# EAGLE design arduino_ver1.0 (EAGLE 9.6.2)
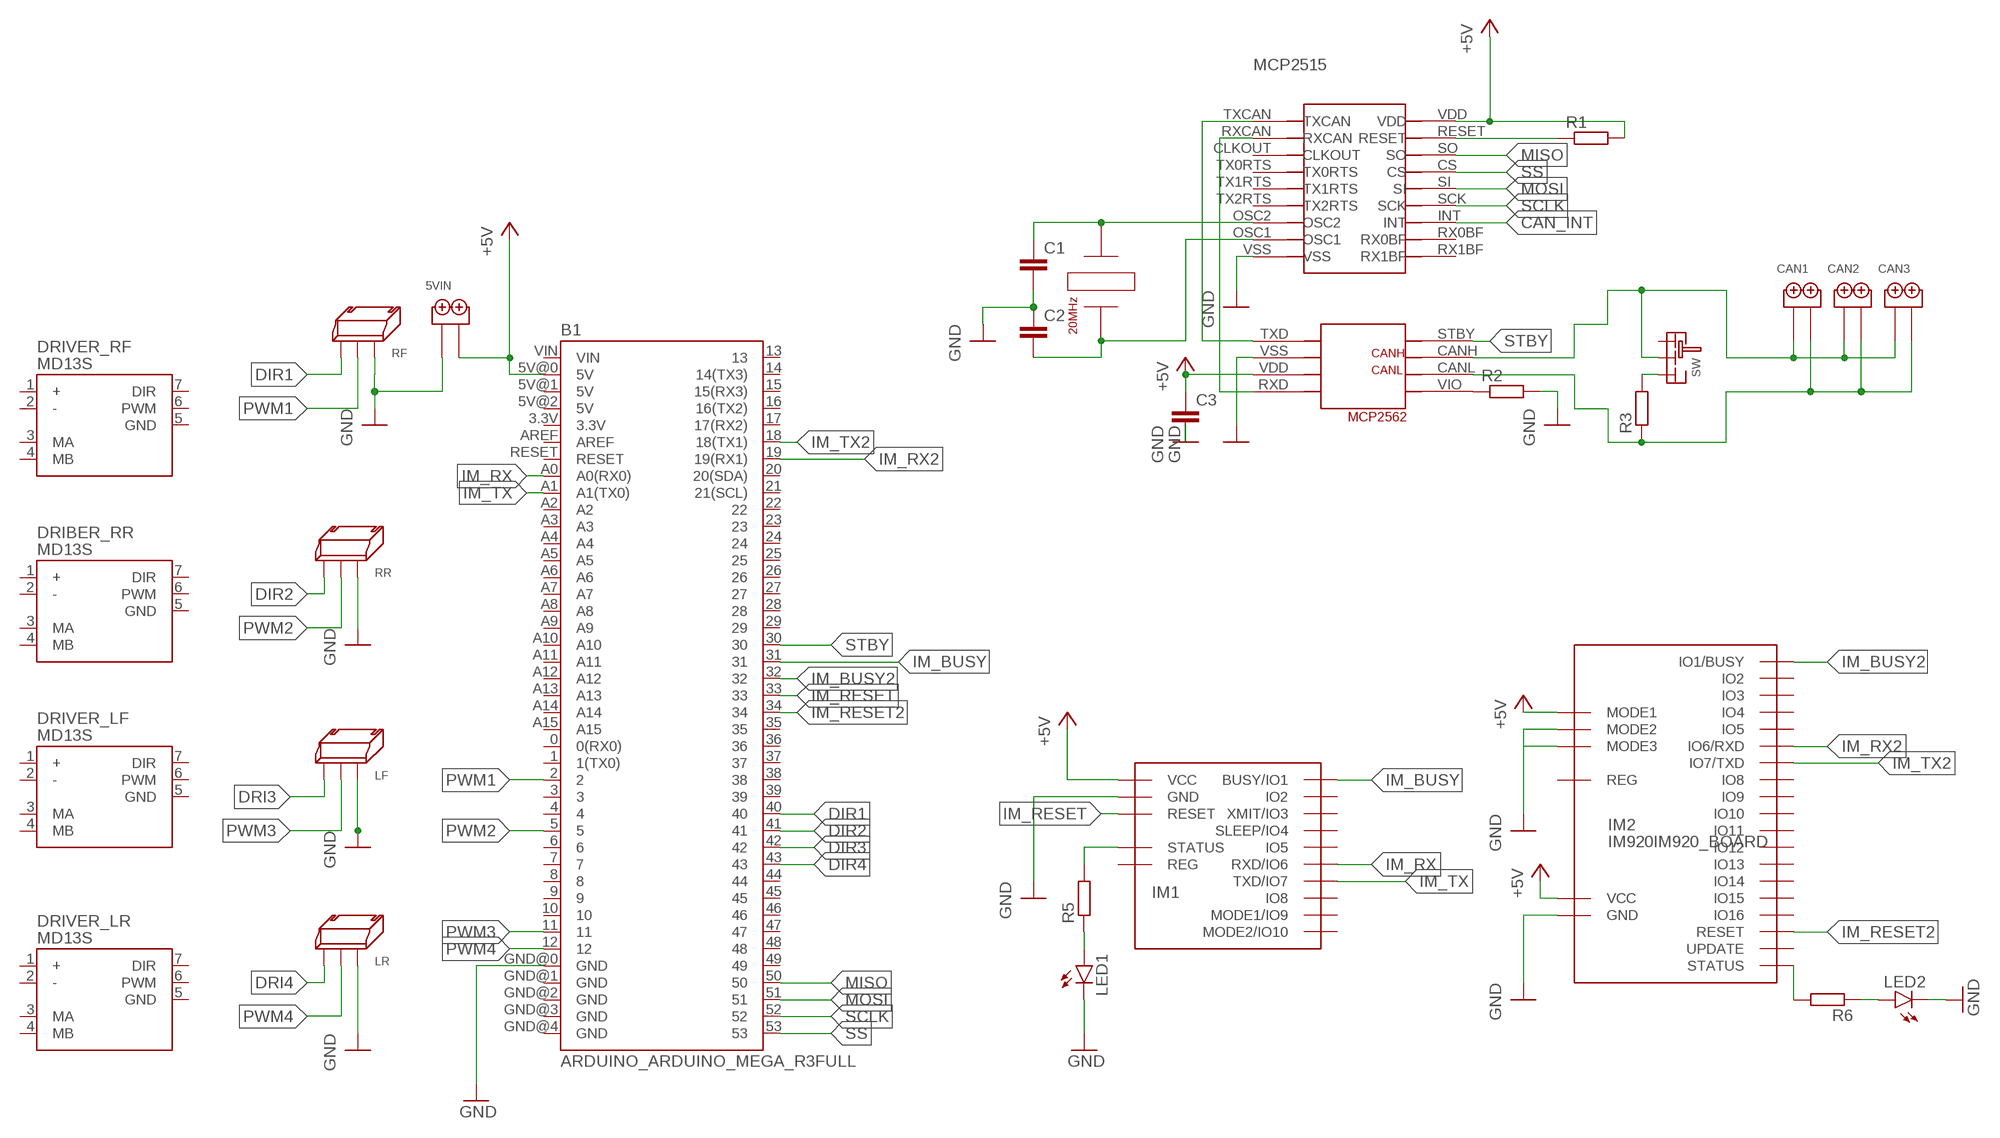
[diagram p0: schematic, sheet 1]

## Parts
5VIN  2PIN  [2PIN]
B1  ARDUINO_ARDUINO_MEGA_R3FULL  [ARDUINO_ARDUINO_MEGA]
C1  C-EU025-024X044  [C025-024X044]
C2  C-EU025-024X044  [C025-024X044]
C3  C-EU025-024X044  [C025-024X044]
CAN1  2PIN  [2PIN]
CAN2  2PIN  [2PIN]
CAN3  2PIN  [2PIN]
DRIBER_RR  MD13S  [MD13S]
DRIVER_LF  MD13S  [MD13S]
DRIVER_LR  MD13S  [MD13S]
DRIVER_RF  MD13S  [MD13S]
IM1  IM920C  [IM920C]
IM2  IM920IM920_BOARD  [IM920_BOARD]
LED1  LED3MM  [LED3MM]
LED2  LED3MM  [LED3MM]
LF  3PIN_SIDE  [3PIN_SIDE]
LR  3PIN_SIDE  [3PIN_SIDE]
MCP2  MCP2515  [MCP2515]
R1  R-EU_0207/10  [0207/10]
R2  R-EU_0207/10  [0207/10]
R3  R-EU_0207/10  [0207/10]
R5  R-EU_0207/10  [0207/10]
R6  R-EU_0207/10  [0207/10]
RF  3PIN_SIDE  [3PIN_SIDE]
RR  3PIN_SIDE  [3PIN_SIDE]
SW  SRIDE_SWITCH  [SRIDE_SWITCH]
U$1  MCP2562  [MCP2562]
U$3  HUSG20  [HUSG20]

## Nets
+5V: 5VIN.P$2 B1.5V@0(5V) C3.1 IM1.$P17(VCC) IM2.IO17(MODE1) IM2.IO23(VCC) MCP2.VDD R1.2 U$1.VDD
CAN_INT: MCP2.INT
DIR1: B1.40 RF.P$2
DIR2: B1.41 RR.P$2
DIR3: B1.42
DIR4: B1.43
DRI3: LF.P$2
DRI4: LR.P$2
GND: B1.GND@0(GND) LED1.K(C) LED2.K(C) R2.2
IM_BUSY: B1.31 IM1.$P1(BUSY/IO1)
IM_BUSY2: B1.32 IM2.IO1(IO1/BUSY)
IM_RESET: B1.33 IM1.$P19(RESET)
IM_RESET2: B1.34 IM2.IO25(RESET)
IM_RX: B1.A0(A0(RX0)) IM1.$P6(RXD/IO6)
IM_RX2: B1.19(19(RX1)) IM2.IO6(IO6/RXD)
IM_TX: B1.A1(A1(TX0)) IM1.$P7(TXD/IO7)
IM_TX2: B1.18(18(TX1)) IM2.IO7(IO7/TXD)
MISO: B1.50 MCP2.SO
MOSI: B1.51 MCP2.SI
N$1: C1.1 MCP2.OSC2 U$3.A
N$2: C2.2 MCP2.OSC1 U$3.B
N$3: MCP2.TXCAN U$1.TXD
N$4: MCP2.RXCAN U$1.RXD
N$5: MCP2.RESET R1.1
N$6: R2.1 U$1.VIO
N$7: CAN1.P$1 CAN2.P$1 CAN3.P$1 SW.LR U$1.CANH
N$8: R3.2 SW.R
N$10: IM2.IO19(MODE3)
N$11: CAN1.P$2 CAN2.P$2 CAN3.P$2 R3.1 U$1.CANL
N$13: LED1.A R5.1
N$14: IM2.IO21(STATUS) R6.2
N$15: LED2.A R6.1
N$16: IM1.$P15(STATUS) R5.2
PWM1: B1.2 RF.P$1
PWM2: B1.5 RR.P$1
PWM3: B1.11 LF.P$1
PWM4: B1.12 LR.P$1
SCLK: B1.52 MCP2.SCK
SS: B1.53 MCP2.CS
STBY: B1.30 U$1.STBY
V-: 5VIN.P$1 C1.2 C2.1 C3.2 IM1.$P18(GND) IM2.IO18(MODE2) IM2.IO24(GND) LF.P$3 LR.P$3 MCP2.VSS RF.P$3 RR.P$3 U$1.VSS ; supply symbol labelled GND
Unconnected: B1.0(0(RX0)) B1.1(1(TX0)) B1.3 B1.3.3V B1.4 B1.5V@1(5V) B1.5V@2(5V) B1.6 B1.7 B1.8 B1.9 B1.10 B1.13 B1.14(14(TX3)) B1.15(15(RX3)) B1.16(16(TX2)) B1.17(17(RX2)) B1.20(20(SDA)) B1.21(21(SCL)) B1.22 B1.23 B1.24 B1.25 B1.26 B1.27 B1.28 B1.29 B1.35 B1.36 B1.37 B1.38 B1.39 B1.44 B1.45 B1.46 B1.47 B1.48 B1.49 B1.A2 B1.A3 B1.A4 B1.A5 B1.A6 B1.A7 B1.A8 B1.A9 B1.A10 B1.A11 B1.A12 B1.A13 B1.A14 B1.A15 B1.AREF B1.GND@1(GND) B1.GND@2(GND) B1.GND@3(GND) B1.GND@4(GND) B1.RESET B1.VIN DRIBER_RR.1(+) DRIBER_RR.2(-) DRIBER_RR.3(MA) DRIBER_RR.4(MB) DRIBER_RR.5(GND) DRIBER_RR.6(PWM) DRIBER_RR.7(DIR) DRIVER_LF.1(+) DRIVER_LF.2(-) DRIVER_LF.3(MA) DRIVER_LF.4(MB) DRIVER_LF.5(GND) DRIVER_LF.6(PWM) DRIVER_LF.7(DIR) DRIVER_LR.1(+) DRIVER_LR.2(-) DRIVER_LR.3(MA) DRIVER_LR.4(MB) DRIVER_LR.5(GND) DRIVER_LR.6(PWM) DRIVER_LR.7(DIR) DRIVER_RF.1(+) DRIVER_RF.2(-) DRIVER_RF.3(MA) DRIVER_RF.4(MB) DRIVER_RF.5(GND) DRIVER_RF.6(PWM) DRIVER_RF.7(DIR) IM1.$P2(IO2) IM1.$P3(XMIT/IO3) IM1.$P4(SLEEP/IO4) IM1.$P5(IO5) IM1.$P8(IO8) IM1.$P9(MODE1/IO9) IM1.$P10(MODE2/IO10) IM1.$P16(REG) IM2.IO2 IM2.IO3 IM2.IO4 IM2.IO5 IM2.IO8 IM2.IO9 IM2.IO10 IM2.IO11 IM2.IO12 IM2.IO13 IM2.IO14 IM2.IO15 IM2.IO16 IM2.IO20(UPDATE) IM2.IO22(REG) MCP2.CLKOUT MCP2.RX0BF MCP2.RX1BF MCP2.TX0RTS MCP2.TX1RTS MCP2.TX2RTS SW.L

## Library data of the parts
5VIN CAN1-CAN3 = TB113-2B-x-x-0-x-x:2PIN
B1 = ArduinoMega:ARDUINO_ARDUINO_MEGA_R3: Arduino Mega R3 ATmega2560 R3 compatible footprint. SparkFun Products: Arduino Mega 2560 R3 <https://www.sparkfun.com/products/11061>
C1-C3 = rcl:C-EU: CAPACITOR, European symbol; SPICEPREFIX: C
DRIBER_RR DRIVER_LF DRIVER_LR DRIVER_RF = Module:MD13S: 13Amp DC Motor Driver (MD13S) Created by: Wai Weng; CYTRON-PC: MD13S; DESC: 13Amp DC Motor Driver - GROVE Compatible; MF: Cytron; MPN: MD13S
IM1 = IM920:IM920C
IM2 = IM920:IM920
LED1 LED2 = led:LED: LED OSRAM: - CHIPLED LG R971, LG N971, LY N971, LG Q971, LY Q971, LO R971, LY R971 LH N974, LH R974 LS Q976, LO Q976, LY Q976 LO Q996 - Hyper CHIPLED LW Q18S LB Q993, LB Q99A, LB R99A - SideLED LS A670, LO A670, LY A670, LG A670, LP A670 LB A673, LV A673, LT A673, LW A673 LH A674 LY A675 LS A676, LA A676, LO A676, LY A676, LW A676 LS A679, LY A679, LG A679 - Hyper Micro SIDELED® LS Y876, LA Y876, LO Y876, LY Y876 LT Y87S - SmartLED LW L88C, LW L88S LB L89C, LB L89S, LG L890 LS L89K, LO L89K, LY L89K LS L896, LA L896, LO L896, LY L896 - TOPLED LS T670, LO T670, LY T670, LG T670, LP T670 LSG T670, LSP T670, LSY T670, LOP T670, LYG T670 LG T671, LOG T671, LSG T671 LB T673, LV T673, LT T673, LW T673 LH T674 LS T676, LA T676, LO T676, LY T676, LB T676, LH T676, LSB T676, LW T676 LB T67C, LV T67C, LT T67C, LS T67K, LO T67K, LY T67K, LW E67C LS E67B, LA E67B, LO E67B, LY E67B, LB E67C, LV E67C, LT E67C LW T67C LS T679, LY T679, LG T679 LS T770, LO T770, LY T770, LG T770, LP T770 LB T773, LV T773, LT T773, LW T773 LH T774 LS E675, LA E675, LY E675, LS T675 LS T776, LA T776, LO T776, LY T776, LB T776 LHGB T686 LT T68C, LB T68C - Hyper Mini TOPLED® LB M676 - Mini TOPLED Santana® LG M470 LS M47K, LO M47K, LY M47K Source: http://www.osram.convergy.de LUXEON: - LUMILED® LXK2-PW12-R00, LXK2-PW12-S00, LXK2-PW14-U00, LXK2-PW14-V00 LXK2-PM12-R00, LXK2-PM12-S00, LXK2-PM14-U00 LXK2-PE12-Q00, LXK2-PE12-R00, LXK2-PE12-S00, LXK2-PE14-T00, LXK2-PE14-U00 LXK2-PB12-K00, LXK2-PB12-L00, LXK2-PB12-M00, LXK2-PB14-N00, LXK2-PB14-P00, LXK2-PB14-Q00 LXK2-PR12-L00, LXK2-PR12-M00, LXK2-PR14-Q00, LXK2-PR14-R00 LXK2-PD12-Q00, LXK2-PD12-R00, LXK2-PD12-S00 LXK2-PH12-R00, LXK2-PH12-S00 LXK2-PL12-P00, LXK2-PL12-Q00, LXK2-PL12-R00 Source: www.luxeon.com KINGBRIGHT: KA-3528ASYC Source: www.kingbright.com
LF LR RF RR = XR Connector:3PIN_SIDE
MCP2 = MCP2515:MCP2515
R1-R3 R5 R6 = rcl:R-EU_: RESISTOR, European symbol; SPICEPREFIX: R
SW = Sride Switch:SRIDE_SWITCH
U$1 = MCP2562:MCP2562
U$3 = HUSG20:HUSG20

## Net classes
0 default: width 0.61 mm
1 power: width 0.914 mm, clearance 0.508 mm

## Board
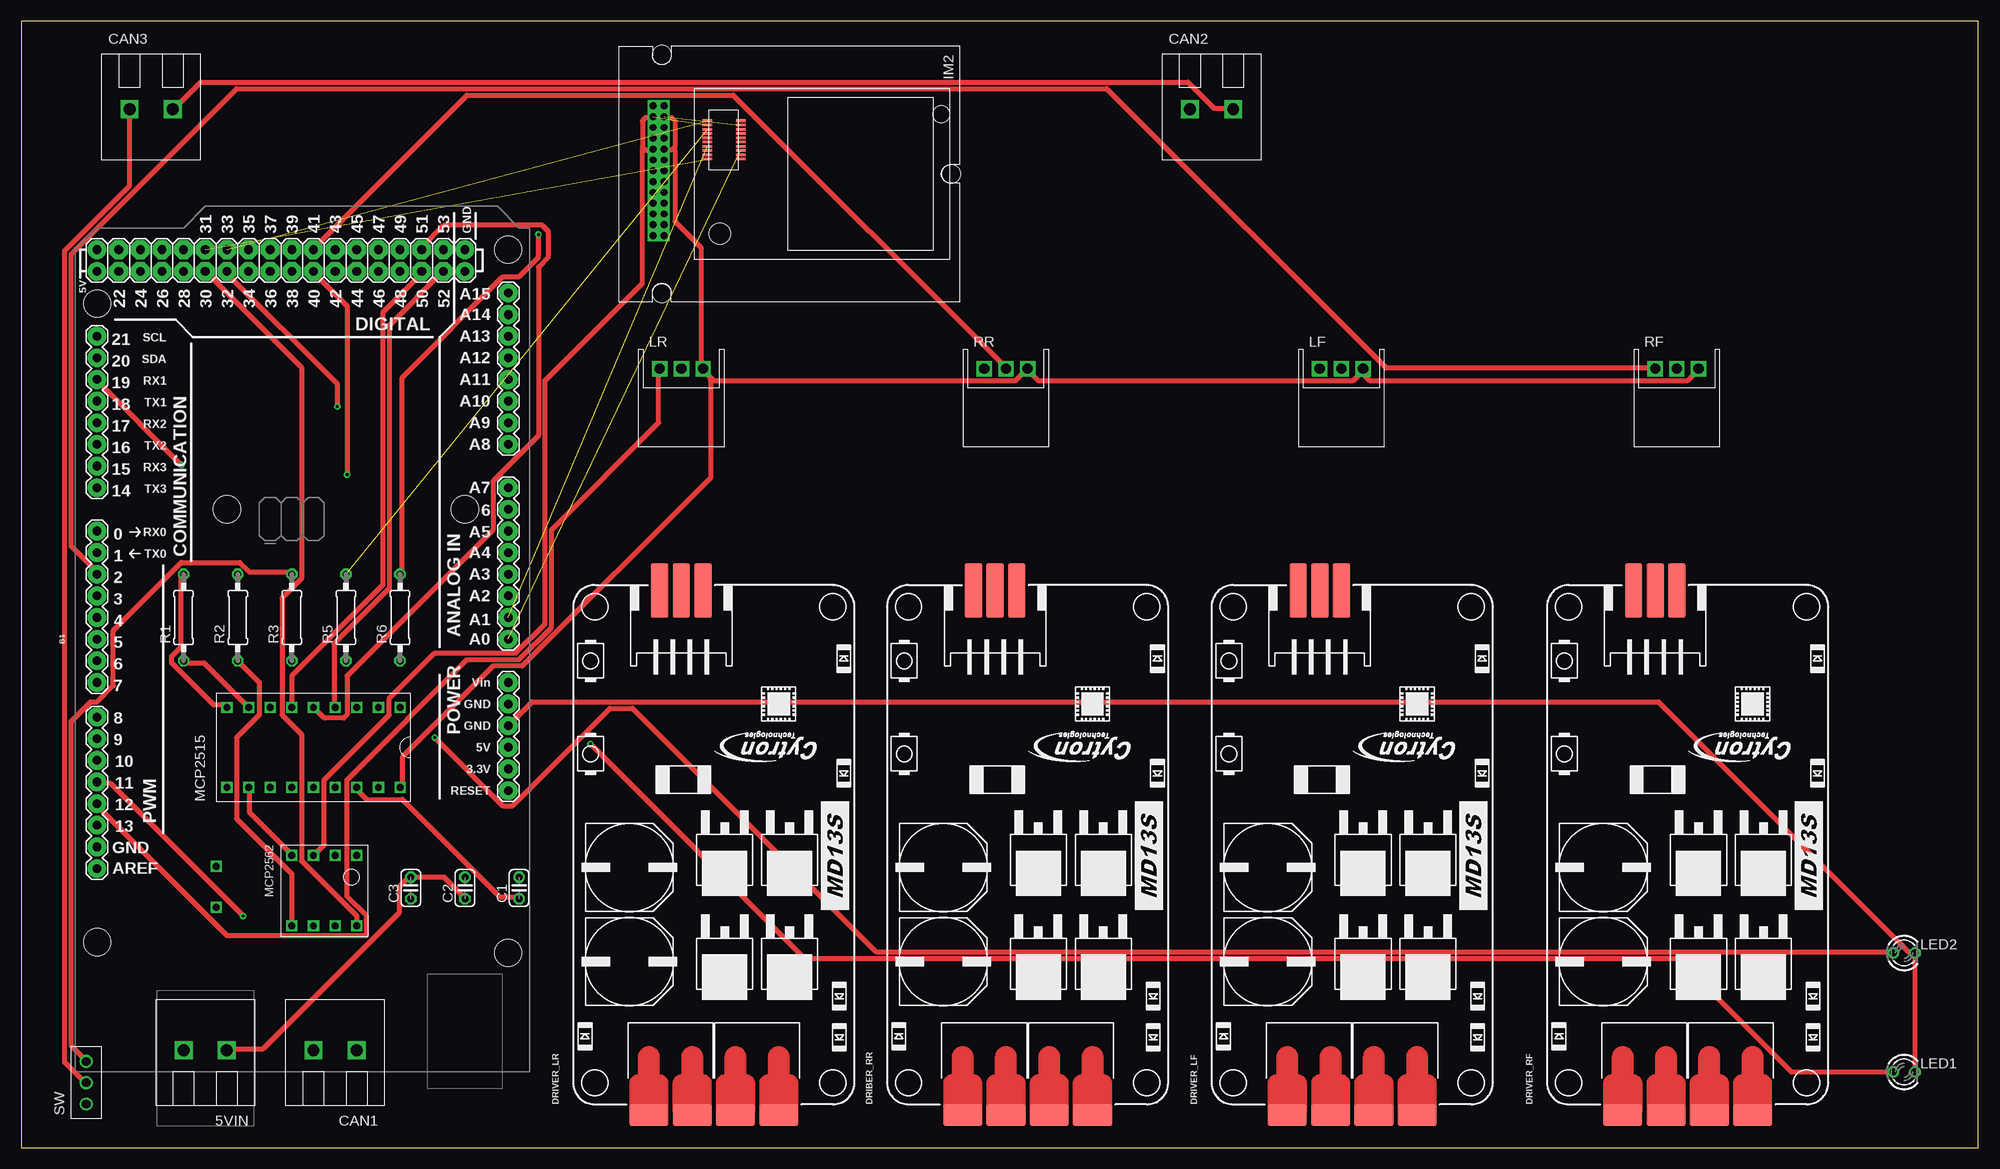
[diagram p1: board, top side]
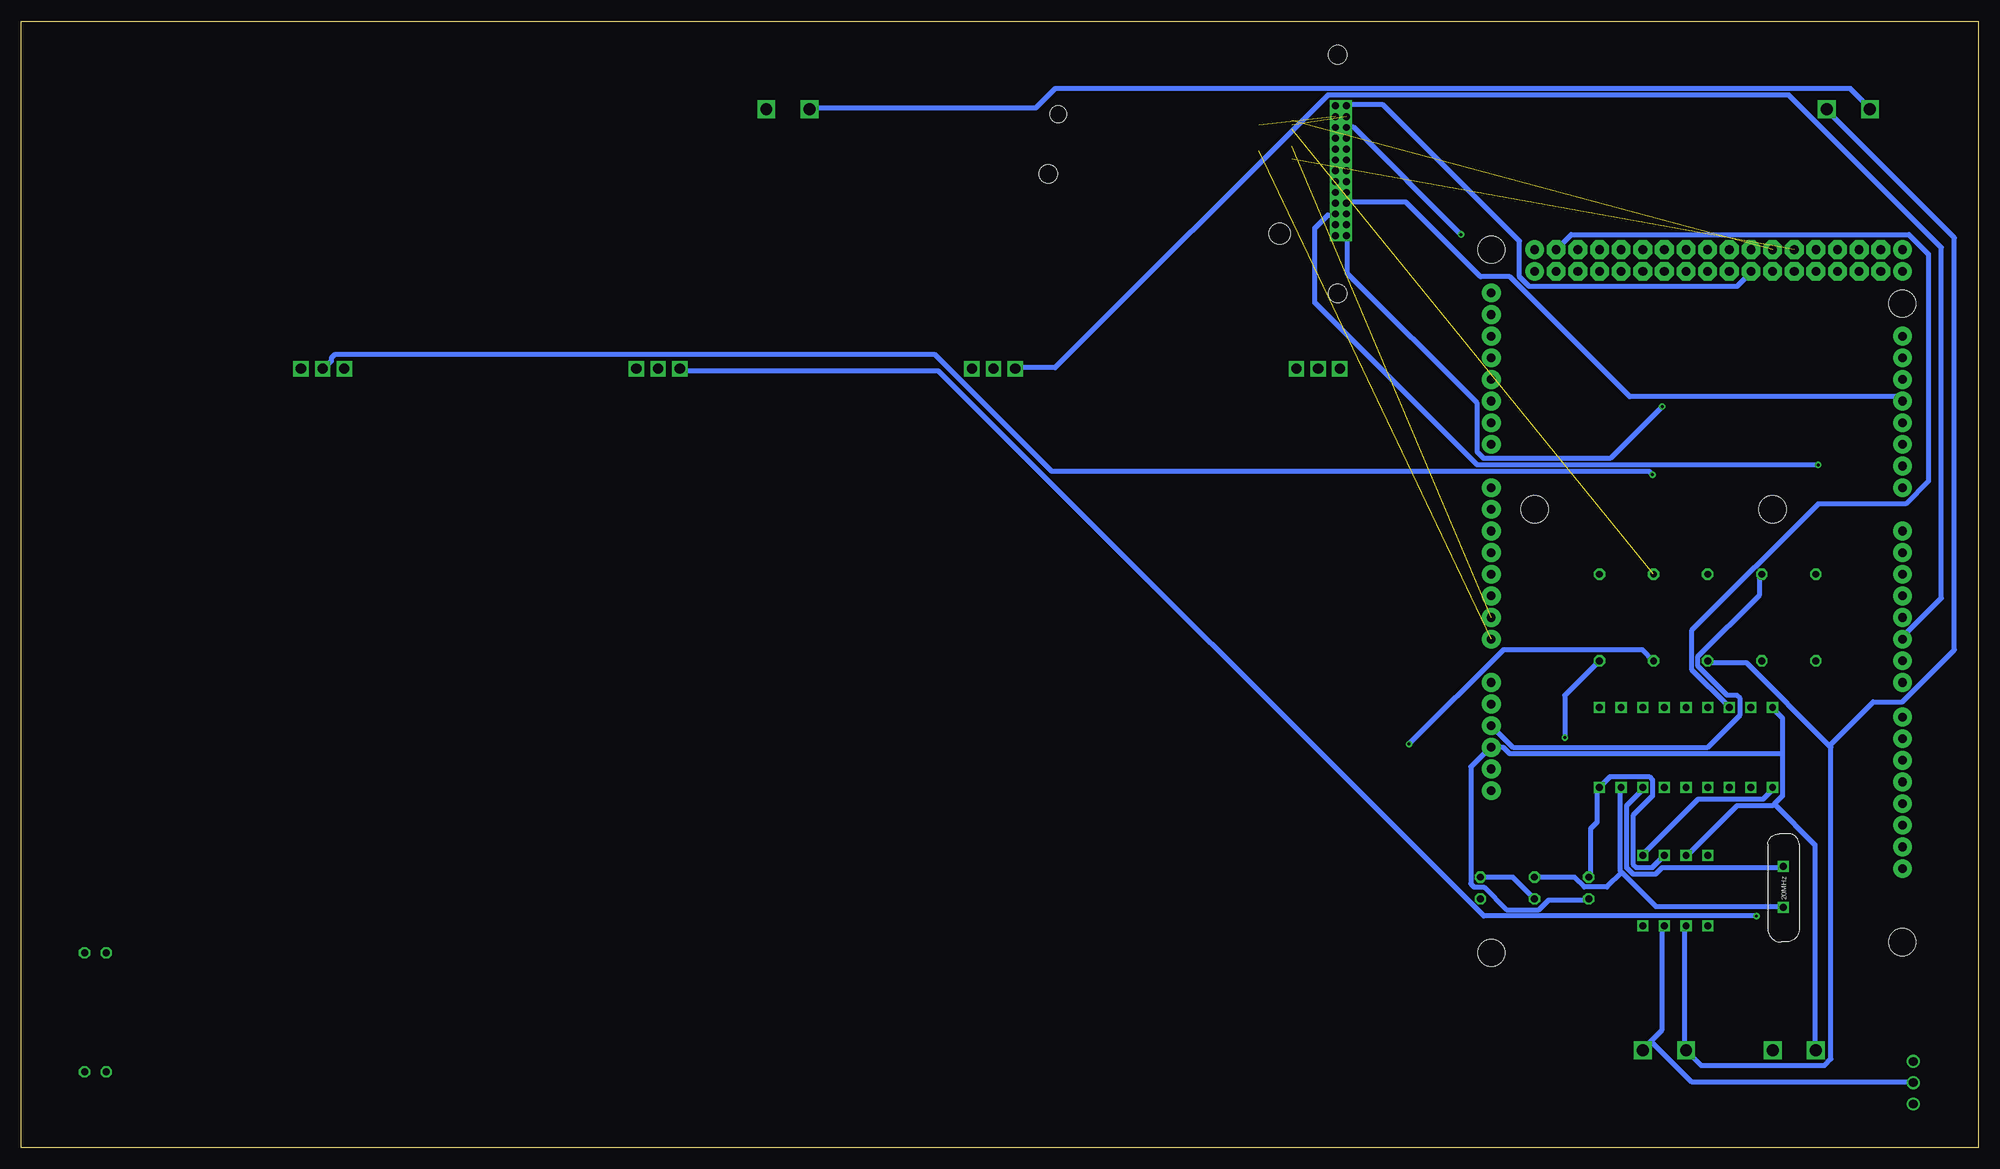
[diagram p2: board, bottom side, seen from below]

Size 229.68 x 132.22 mm. Coordinates in mm from the lower left corner, seen from the top.
Outline: 0,0 229.68,0 229.68,132.22 0,132.22 0,0
Copper layers (1*16): Top 0.035mm / dielectric 1.5mm / Bottom 0.035mm
Design rules "default": minimum track width 6mil, minimum drill 0.35mm, track to track 6mil, track to pad 6mil, pad to pad 6mil, via to via 6mil, smd to smd 6mil, copper to edge 40mil, drill to drill 6mil, minimum pad ring 10mil, minimum via ring 8mil, stop-mask expansion 4mil, vias tented up to drill 0mil, thermal gap 10mil

### Footprints (pad centres in the part's own frame; a part is rotated, then mirrored left to right if it is on the bottom)
2PIN = drill 1.4 square: P$1 -2.54,0; P$2 2.54,0
ARDUINO_ARDUINO_MEGA = drill 1.016 pad 2.2: 0 13.97,24.13; 1 11.43,24.13; 2 8.89,24.13; 3 6.35,24.13; 3.3V -13.97,-24.13; 4 3.81,24.13; 5 1.27,24.13; 5V@0 -11.43,-24.13; 5V@1 44.45,24.13; 5V@2 46.99,24.13; 6 -1.27,24.13; 7 -3.81,24.13; 8 -7.874,24.13; 9 -10.414,24.13; 10 -12.954,24.13; 11 -15.494,24.13; 12 -18.034,24.13; 13 -20.574,24.13; 14 19.05,24.13; 15 21.59,24.13; 16 24.13,24.13; 17 26.67,24.13; 18 29.21,24.13; 19 31.75,24.13; 20 34.29,24.13; 21 36.83,24.13; A0 1.27,-24.13; A1 3.81,-24.13; A2 6.35,-24.13; A3 8.89,-24.13; A4 11.43,-24.13; A5 13.97,-24.13; A6 16.51,-24.13; A7 19.05,-24.13; A8 24.13,-24.13; A9 26.67,-24.13; A10 29.21,-24.13; A11 31.75,-24.13; A12 34.29,-24.13; A13 36.83,-24.13; A14 39.37,-24.13; A15 41.91,-24.13; AREF -25.654,24.13; GND@0 -8.89,-24.13; GND@1 -6.35,-24.13; GND@2 44.45,-19.05; GND@3 46.99,-19.05; GND@4 -23.114,24.13; RESET -16.51,-24.13; VIN -3.81,-24.13 | drill 1.016 pad 2.2 octagon: 22 44.45,21.59; 23 46.99,21.59; 24 44.45,19.05; 25 46.99,19.05; 26 44.45,16.51; 27 46.99,16.51; 28 44.45,13.97; 29 46.99,13.97; 30 44.45,11.43; 31 46.99,11.43; 32 44.45,8.89; 33 46.99,8.89; 34 44.45,6.35; 35 46.99,6.35; 36 44.45,3.81; 37 46.99,3.81; 38 44.45,1.27; 39 46.99,1.27; 40 44.45,-1.27; 41 46.99,-1.27; 42 44.45,-3.81; 43 46.99,-3.81; 44 44.45,-6.35; 45 46.99,-6.35; 46 44.45,-8.89; 47 46.99,-8.89; 48 44.45,-11.43; 49 46.99,-11.43; 50 44.45,-13.97; 51 46.99,-13.97; 52 44.45,-16.51; 53 46.99,-16.51 | hole 3.2: -34.29,24.13; -35.56,-24.13; 16.51,8.89; 16.51,-19.05; 40.64,24.13; 46.99,-24.13
C025-024X044 = drill 0.813 octagon: 1 -1.27,0; 2 1.27,0
MD13S = smd 2.54 x 4.572: 1 -1.27,24.13; 2 -1.27,19.05; 3 -1.27,13.97; 4 -1.27,8.89 | smd 6.35 x 2.032: 5 60.325,17.78; 6 60.325,20.32; 7 60.325,22.86
IM920C = smd 0.3 x 1.1: $P1 -1.75,-13.45; $P2 -1.75,-9.55; $P3 -2.25,-13.45; $P4 -2.25,-9.55; $P5 -2.75,-13.45; $P6 -2.75,-9.55; $P7 -3.25,-13.45; $P8 -3.25,-9.55; $P9 -3.75,-13.45; $P10 -3.75,-9.55; $P11 -4.25,-13.45; $P12 -4.25,-9.55; $P13 -4.75,-13.45; $P14 -4.75,-9.55; $P15 -5.25,-13.45; $P16 -5.25,-9.55; $P17 -5.75,-13.45; $P18 -5.75,-9.55; $P19 -6.25,-13.45; $P20 -6.25,-9.55 | hole 2.5: 7,-12 | hole 2: -7,14
IM920_BOARD = drill 0.8 pad 0.813 square: IO1 7.24,-17.27; IO2 7.24,-16; IO3 5.97,-17.27; IO4 5.97,-16; IO5 4.7,-17.27; IO6 4.7,-16; IO7 3.43,-17.27; IO8 3.43,-16; IO9 2.16,-17.27; IO10 2.16,-16; IO11 0.89,-17.27; IO12 0.89,-16; IO13 -0.38,-17.27; IO14 -0.38,-16; IO15 -1.65,-17.27; IO16 -1.65,-16; IO17 -2.92,-17.27; IO18 -2.92,-16; IO19 -4.19,-17.27; IO20 -4.19,-16; IO21 -5.46,-17.27; IO22 -5.46,-16; IO23 -6.73,-17.27; IO24 -6.73,-16; IO25 -8,-17.27; IO26 -8,-16 | hole 2.2: -14,-16.27; 14,-16.27; 0,17.73
LED3MM = drill 0.813 octagon: A -1.27,0; K 1.27,0
3PIN_SIDE = drill 1.2 square: P$1 -2.54,0; P$2 0,0; P$3 2.54,0
MCP2515 = drill 0.8 square: CLKOUT -4.7,5.08; CS 4.7,5.08; INT 4.7,-5.08; OSC1 -4.7,-7.62; OSC2 -4.7,-5.08; RESET 4.7,7.62; RX0BF 4.7,-7.62; RX1BF 4.7,-10.16; RXCAN -4.7,7.62; SCK 4.7,-2.54; SI 4.7,0; SO 4.7,2.54; TX0RTS -4.7,2.54; TX1RTS -4.7,0; TX2RTS -4.7,-2.54; TXCAN -4.7,10.16; VDD 4.7,10.16; VSS -4.7,-10.16
0207/10 = drill 0.813 octagon: 1 -5.08,0; 2 5.08,0
SRIDE_SWITCH = drill 1: L -2.5,0; LR 0,0; R 2.5,0
MCP2562 = drill 0.8 square: CANH 8.255,6.35; CANL 8.255,3.81; RXD 0,1.27; STBY 8.255,8.89; TXD 0,8.89; VDD 0,3.81; VIO 8.255,1.27; VSS 0,6.35
HUSG20 = drill 0.8 square: A 1.27,0; B 6.07,0

### Placement (x,y rotation side)
5VIN  21.59,11.43 180 top
B1  33.02,58.42 90 top
C1  58.42,30.48 90 top
C2  52.07,30.48 90 top
C3  45.72,30.48 90 top
CAN1  36.83,11.43 180 top
CAN2  139.7,121.92 0 top
CAN3  15.24,121.92 0 top
DRIBER_RR  134.62,5.08 90 top
DRIVER_LF  172.72,5.08 90 top
DRIVER_LR  97.79,5.08 90 top
DRIVER_RF  212.09,5.08 90 top
IM1  93.98,114.3 270 top
IM2  91.44,114.3 270 top
LED1  220.98,8.89 0 top
LED2  220.98,22.86 0 top
LF  154.94,91.44 0 top
LR  77.47,91.44 0 top
MCP2  34.29,46.99 90 top
R1  19.05,62.23 90 top
R2  25.4,62.23 90 top
R3  31.75,62.23 90 top
R5  38.1,62.23 90 top
R6  44.45,62.23 90 top
RF  194.31,91.44 0 top
RR  115.57,91.44 0 top
SW  7.62,7.62 90 top
U$1  30.48,34.29 270 top
U$3  22.86,34.29 270 bottom

### Tracks (layer width: path | path; a pad name or v marks a point on that pad's centre or on a via)
+5V  (1 unrouted)
  Top 0.61: 73.09,117.28 72.9,117.47 72.9,120.52 73.28,120.9 74.04,120.9 IM2.IO23 | 73.09,117.28 73.28,117.09 74.04,117.09 IM2.IO17 | R1.2 18.8,67.18 18.8,58.8 17.65,57.66 17.65,56.9 22.61,51.94 24.13,51.94 MCP2.VDD | U$1.VDD 35.56,35.56 35.56,43.18 43.18,50.8 43.18,52.71 48.51,58.04 58.04,58.04 61.47,61.47 61.47,90.04 72.9,101.47 72.9,117.09 73.09,117.28
  Bottom 0.61: C3.1 45.85,29.08 50.42,29.08 51.56,27.94 55.37,27.94 58.04,30.61 59.18,30.61 59.56,30.99 59.56,44.7 57.28,46.99 B1.5V@0 55.75,46.99 54.99,46.23 22.99,46.23 | 23.94,40.32 22.99,41.28 22.99,46.23 | 23.94,40.32 24.13,40.13 28.32,40.13 34.04,34.42 U$1.VDD | 22.99,46.23 22.99,50.42 24.13,51.56 MCP2.VDD | 23.94,40.32 19.18,35.56 19.18,11.56 5VIN.P$2
DIR1  (via drill 0.35)
  Top 0.61: v38.23,78.99 38.23,98.81 34.42,102.62 B1.40
  Bottom 0.61: v38.23,78.99 38.61,79.38 108.71,79.38 122.43,93.09 192.91,93.09 193.29,92.71 193.29,92.33 194.06,91.57 RF.P$2
DIR2
  Top 0.61: RR.P$2 115.57,91.57 83.57,123.57 52.32,123.57 34.42,105.66 B1.41
GND
  Top 0.61: LED1.K LED2.K 222.25,22.99 221.49,22.99 192.15,52.32 59.94,52.32 B1.GND@0
  Bottom 0.61: B1.GND@0 54.61,46.99 31.75,46.99 27.94,50.8 27.94,52.71 28.32,53.09 29.46,53.09 32.89,56.52 32.89,57.66 25.65,64.9 25.65,67.18 R2.2
IM_BUSY  (1 unrouted)
IM_BUSY2  (via drill 0.35)
  Top 0.61: v37.08,86.99 37.08,89.66 24.13,102.62 B1.32
  Bottom 0.61: v37.08,86.99 43.18,80.9 58.04,80.9 58.8,81.66 58.8,87.38 74.04,102.62 74.04,106.81 IM2.IO1
IM_RESET  (1 unrouted)
IM_RESET2
  Bottom 0.61: IM2.IO25 74.04,122.43 69.85,122.43 53.85,106.43 53.85,102.23 52.7,101.09 28.32,101.09 26.8,102.62 B1.34
IM_RX  (1 unrouted)
IM_RX2  (via drill 0.35)
  Top 0.61: v18.8,80.14 8.89,90.04 B1.19
  Bottom 0.61: v18.8,80.14 58.8,80.14 77.85,99.19 77.85,107.95 76.33,109.47 75.56,109.47 IM2.IO6
IM_TX  (1 unrouted)
IM_TX2
  Bottom 0.61: IM2.IO7 74.04,111 67.18,111 58.42,102.23 54.99,102.23 40.89,88.14 9.27,88.14 8.89,87.76 B1.18
MISO
  Top 0.61: MCP2.SO 31.75,55.37 42.42,66.04 42.42,98.04 46.99,102.62 B1.50
MOSI
  Top 0.61: MCP2.SI 34.42,51.56 35.56,50.42 37.85,50.42 38.23,50.8 38.23,55.37 55.37,72.52 55.37,78.23 60.71,83.57 60.71,103.38 61.85,104.52 61.85,107.57 61.09,108.33 49.66,108.33 46.99,105.66 B1.51
N$1
  Top 0.61: C1.1 58.42,29.46 56.13,29.46 44.7,40.89 40.51,40.89 39.37,42.04 MCP2.OSC2
  Bottom 0.61: U$3.A 22.99,32.89 37.08,32.89 37.85,32.13 40.51,32.13 41.28,32.89 41.28,40.13 39.37,42.04 MCP2.OSC2
N$2
  Bottom 0.61: 41.85,32.32 42.04,32.51 42.04,42.04 MCP2.OSC1 | 41.85,32.32 37.85,28.32 22.99,28.32 U$3.B | C2.2 47.37,31.75 46.23,30.61 43.56,30.61 41.85,32.32
N$3
  Bottom 0.61: U$1.TXD 39.37,34.42 32.89,40.89 25.27,40.89 24.13,42.04 MCP2.TXCAN
N$4
  Top 0.61: MCP2.RXCAN 26.8,42.04 26.8,39.37 31.75,34.42 U$1.RXD
N$5
  Top 0.61: MCP2.RESET 26.42,51.94 21.46,56.9 19.18,56.9 R1.1
N$6
  Top 0.61: U$1.VIO 31.75,32.13 25.27,38.61 25.27,48.13 27.94,50.8 27.94,54.61 R2.1
N$7
  Top 0.61: CAN3.P$1 12.7,112.9 5.08,105.28 5.08,10.03 7.37,7.75 SW.LR
  Bottom 0.61: 38.42,12.51 39.37,11.56 CAN1.P$1 | 38.42,12.51 37.08,13.84 37.08,26.04 U$1.CANH | 38.42,12.51 33.66,7.75 7.75,7.75 SW.LR | CAN2.P$1 136.91,122.05 110.62,122.05 108.33,124.33 14.99,124.33 12.7,122.05 CAN3.P$1
N$8
  Top 0.61: R3.2 31.75,67.56 26.8,67.56 25.65,68.71 18.8,68.71 10.79,60.71 10.79,54.23 8.89,52.32 8.13,52.32 5.84,50.04 5.84,11.94 7.37,10.41 SW.R
N$11
  Top 0.61: CAN2.P$2 142.24,122.05 139.95,122.05 136.91,125.09 21.08,125.09 18.03,122.05 CAN3.P$2
  Bottom 0.61: U$1.CANL 34.42,26.04 34.42,11.56 CAN1.P$2 32.51,9.65 18.03,9.65 17.27,10.41 17.27,46.99 17.46,47.18 | 17.46,47.18 27.18,56.9 31.75,56.9 R3.1 | 17.46,47.18 12.32,52.32 8.89,52.32 2.79,58.42 2.79,106.81 17.65,121.67 CAN3.P$2
N$13  (via drill 0.35)
  Top 0.61: LED1.A 207.77,8.89 194.44,22.22 91.95,22.22 v66.8,47.37
  Bottom 0.61: v66.8,47.37 55.75,58.42 39.37,58.42 R5.1
N$14  (via drill 0.35)
  Top 0.61: v60.71,107.19 60.71,104.52 58.42,102.23 56.52,102.23 44.7,90.42 44.7,67.56 R6.2
  Bottom 0.61: v60.71,107.19 73.28,119.76 74.04,119.76 IM2.IO21
N$15  (via drill 0.35)
  Top 0.61: v48.51,48.13 56.52,40.13 57.66,40.13 69.09,51.56 71.76,51.56 100.33,22.99 219.58,22.99 LED2.A
  Bottom 0.61: v48.51,48.13 48.51,53.09 R6.1
N$16  (1 unrouted)
PWM1
  Top 0.61: RF.P$1 191.77,91.57 160.15,91.57 127.38,124.33 25.27,124.33 5.84,104.9 5.84,70.61 8.89,67.56 B1.2
PWM2
  Bottom 0.61: RR.P$1 112.9,91.57 108.33,91.57 76.33,123.57 22.22,123.57 4.32,105.66 4.32,64.52 8.89,59.94 B1.5
PWM3  (via drill 0.35)
  Top 0.61: v26.04,27.18 10.41,42.8 8.89,42.8 B1.11
  Bottom 0.61: v26.04,27.18 58.04,27.18 122.05,91.19 152.15,91.19 LF.P$1
PWM4
  Top 0.61: LR.P$1 74.8,91.19 74.8,85.09 62.23,72.52 62.23,61.09 58.42,57.28 52.32,57.28 38.23,43.18 38.23,29.46 40.51,27.18 40.51,24.89 24.13,24.89 8.89,40.13 B1.12
SCLK
  Top 0.61: B1.52 43.18,96.52 43.18,65.66 36.7,59.18 36.7,51.94 MCP2.SCK
SS
  Bottom 0.61: B1.53 47.75,107.19 8.13,107.19 5.84,104.9 5.84,78.23 8.51,75.56 18.8,75.56 33.66,60.71 33.66,56.13 29.46,51.94 MCP2.CS
STBY
  Top 0.61: U$1.STBY 39.37,27.18 32.89,33.66 32.89,48.51 30.61,50.8 30.61,64.52 32.89,66.8 32.89,91.57 B1.30
V-  (1 unrouted)
  Top 0.61: C2.1 51.94,29.46 49.66,31.75 C3.2 45.47,31.75 44.32,30.61 44.32,27.56 28.32,11.56 24.13,11.56 5VIN.P$1 | 76.52,117.28 76.71,117.47 76.71,120.52 76.33,120.9 75.56,120.9 IM2.IO24 | 76.52,117.28 76.33,117.09 75.56,117.09 IM2.IO18 | 76.52,117.28 76.71,117.09 76.71,108.71 79.76,105.66 79.76,91.57 LR.P$3 80.14,91.19 81.09,90.23 | 81.09,90.23 81.28,90.04 116.71,90.04 RR.P$3 118.24,91.19 119.38,90.04 156.34,90.04 157.48,91.19 LF.P$3 157.48,90.8 158.24,90.04 195.58,90.04 196.72,91.19 RF.P$3 | MCP2.VSS 44.7,42.42 44.7,45.85 55.37,56.52 58.8,56.52 80.9,78.61 80.9,90.04 81.09,90.23
  Bottom 0.61: U$1.VSS 38.23,32.89 40.13,32.89 40.51,33.27 40.51,38.99 38.23,41.28 38.23,43.18 38.61,43.56 43.18,43.56 44.32,42.42 MCP2.VSS 44.7,42.04 44.7,38.23 45.47,37.47 45.47,31.75 C3.2 | C1.2 54.61,31.75 C2.1